# Altium schematic sheet Header Pinout.SchDoc
size A
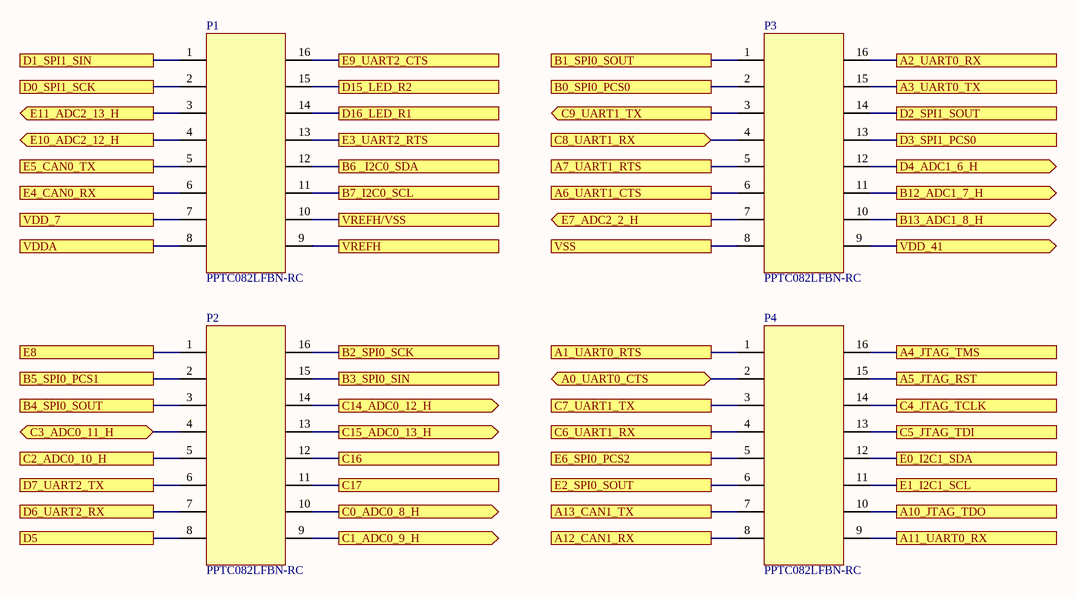
[diagram p0: Header Pinout.SchDoc]

## Parts
P1  PPTC082LFBN-RC  [PPTC082LFBN-RC]
P2  PPTC082LFBN-RC  [PPTC082LFBN-RC]
P3  PPTC082LFBN-RC  [PPTC082LFBN-RC]
P4  PPTC082LFBN-RC  [PPTC082LFBN-RC]

## Ports
A0_UART0_CTS (bidir), A1_UART0_RTS, A2_UART0_RX, A3_UART0_TX, A4_JTAG_TMS, A5_JTAG_RST, A6_UART1_CTS, A7_UART1_RTS, A10_JTAG_TDO, A11_UART0_RX, A12_CAN1_RX, A13_CAN1_TX, B0_SPI0_PCS0, B1_SPI0_SOUT, B2_SPI0_SCK, B3_SPI0_SIN, B4_SPI0_SOUT, B5_SPI0_PCS1, B6 _I2C0_SDA, B7_I2C0_SCL, B12_ADC1_7_H (out), B13_ADC1_8_H (out), C0_ADC0_8_H (out), C1_ADC0_9_H (out), C2_ADC0_10_H, C3_ADC0_11_H (bidir), C4_JTAG_TCLK, C5_JTAG_TDI, C6_UART1_RX, C7_UART1_TX, C8_UART1_RX (in), C9_UART1_TX (out), C14_ADC0_12_H (out), C15_ADC0_13_H (out), C16, C17, D0_SPI1_SCK, D1_SPI1_SIN, D2_SPI1_SOUT, D3_SPI1_PCS0, D4_ADC1_6_H (out), D5, D6_UART2_RX, D7_UART2_TX, D15_LED_R2, D16_LED_R1, E0_I2C1_SDA, E1_I2C1_SCL, E2_SPI0_SOUT, E3_UART2_RTS, E4_CAN0_RX, E5_CAN0_TX, E6_SPI0_PCS2, E7_ADC2_2_H (out), E8, E9_UART2_CTS, E10_ADC2_12_H (out), E11_ADC2_13_H (out), VDD_7, VDD_41 (out), VDDA, VREFH, VREFH/VSS, VSS

## Nets
A0_UART0_CTS: P4.2 ; port A0_UART0_CTS
A1_UART0_RTS: P4.1 ; port A1_UART0_RTS
A2_UART0_RX: P3.16 ; port A2_UART0_RX
A3_UART0_TX: P3.15 ; port A3_UART0_TX
A4_JTAG_TMS: P4.16 ; port A4_JTAG_TMS
A5_JTAG_RST: P4.15 ; port A5_JTAG_RST
A6_UART1_CTS: P3.6 ; port A6_UART1_CTS
A7_UART1_RTS: P3.5 ; port A7_UART1_RTS
A10_JTAG_TDO: P4.10 ; port A10_JTAG_TDO
A11_UART0_RX: P4.9 ; port A11_UART0_RX
A12_CAN1_RX: P4.8 ; port A12_CAN1_RX
A13_CAN1_TX: P4.7 ; port A13_CAN1_TX
B0_SPI0_PCS0: P3.2 ; port B0_SPI0_PCS0
B1_SPI0_SOUT: P3.1 ; port B1_SPI0_SOUT
B2_SPI0_SCK: P2.16 ; port B2_SPI0_SCK
B3_SPI0_SIN: P2.15 ; port B3_SPI0_SIN
B4_SPI0_SOUT: P2.3 ; port B4_SPI0_SOUT
B5_SPI0_PCS1: P2.2 ; port B5_SPI0_PCS1
B6 _I2C0_SDA: P1.12 ; port B6 _I2C0_SDA
B7_I2C0_SCL: P1.11 ; port B7_I2C0_SCL
B12_ADC1_7_H: P3.11 ; port B12_ADC1_7_H
B13_ADC1_8_H: P3.10 ; port B13_ADC1_8_H
C0_ADC0_8_H: P2.10 ; port C0_ADC0_8_H
C1_ADC0_9_H: P2.9 ; port C1_ADC0_9_H
C2_ADC0_10_H: P2.5 ; port C2_ADC0_10_H
C3_ADC0_11_H: P2.4 ; port C3_ADC0_11_H
C4_JTAG_TCLK: P4.14 ; port C4_JTAG_TCLK
C5_JTAG_TDI: P4.13 ; port C5_JTAG_TDI
C6_UART1_RX: P4.4 ; port C6_UART1_RX
C7_UART1_TX: P4.3 ; port C7_UART1_TX
C8_UART1_RX: P3.4 ; port C8_UART1_RX
C9_UART1_TX: P3.3 ; port C9_UART1_TX
C14_ADC0_12_H: P2.14 ; port C14_ADC0_12_H
C15_ADC0_13_H: P2.13 ; port C15_ADC0_13_H
C16: P2.12 ; port C16
C17: P2.11 ; port C17
D0_SPI1_SCK: P1.2 ; port D0_SPI1_SCK
D1_SPI1_SIN: P1.1 ; port D1_SPI1_SIN
D2_SPI1_SOUT: P3.14 ; port D2_SPI1_SOUT
D3_SPI1_PCS0: P3.13 ; port D3_SPI1_PCS0
D4_ADC1_6_H: P3.12 ; port D4_ADC1_6_H
D5: P2.8 ; port D5
D6_UART2_RX: P2.7 ; port D6_UART2_RX
D7_UART2_TX: P2.6 ; port D7_UART2_TX
D15_LED_R2: P1.15 ; port D15_LED_R2
D16_LED_R1: P1.14 ; port D16_LED_R1
E0_I2C1_SDA: P4.12 ; port E0_I2C1_SDA
E1_I2C1_SCL: P4.11 ; port E1_I2C1_SCL
E2_SPI0_SOUT: P4.6 ; port E2_SPI0_SOUT
E3_UART2_RTS: P1.13 ; port E3_UART2_RTS
E4_CAN0_RX: P1.6 ; port E4_CAN0_RX
E5_CAN0_TX: P1.5 ; port E5_CAN0_TX
E6_SPI0_PCS2: P4.5 ; port E6_SPI0_PCS2
E7_ADC2_2_H: P3.7 ; port E7_ADC2_2_H
E8: P2.1 ; port E8
E9_UART2_CTS: P1.16 ; port E9_UART2_CTS
E10_ADC2_12_H: P1.4 ; port E10_ADC2_12_H
E11_ADC2_13_H: P1.3 ; port E11_ADC2_13_H
VDD_7: P1.7 ; port VDD_7
VDD_41: P3.9 ; port VDD_41
VDDA: P1.8 ; port VDDA
VREFH: P1.9 ; port VREFH
VREFH/VSS: P1.10 ; port VREFH/VSS
VSS: P3.8 ; port VSS

## Library data of the parts
P1-P4 = 23: 2x8 female header; Manufacturer_id: 1; idConn: 23; Value: CONN; Voltage_Rating: V; Num_Contacts: 16; Num_Rows: 2; Pitch: 2.54; Created_By: Austin; Updated_By: Null; Drawer_id: 1; Name: PPTC082LFBN-RC; Package: Conn; MfrPartNo: PPTC082LFBN-RC; Link: https://www.digikey.com/product-detail/en/sullins-connector-solutions/PPTC082LFBN-RC/S7076-ND/810214; ComponentLink1Description: Null; ComponentLink1URL: Null; Supplier1: Digi-Key; Supplier1PartNo: S7076-ND; Created_Date: 12/15/2018